# Altium schematic sheet PWM Generation.SchDoc: FET Drive PWM Circuit
size 246 x 182 mm; SheetNumber: 2; SheetTotal: 2; Page Create Date: March  8, 1995; OrgName: University of Illinois at Urbana-Champaign; Page Number: 3; Page Size: A; Page Count: 6; RevCode: 4; Doc: SK0003; DsnPath: C:\Users\w14r2\Downloads\FETBOX REV 4.DSN; SchematicName: FET Box Redesign Schematics; PageName: C - PWM Generation; PageSize: A; TopSchematic: True
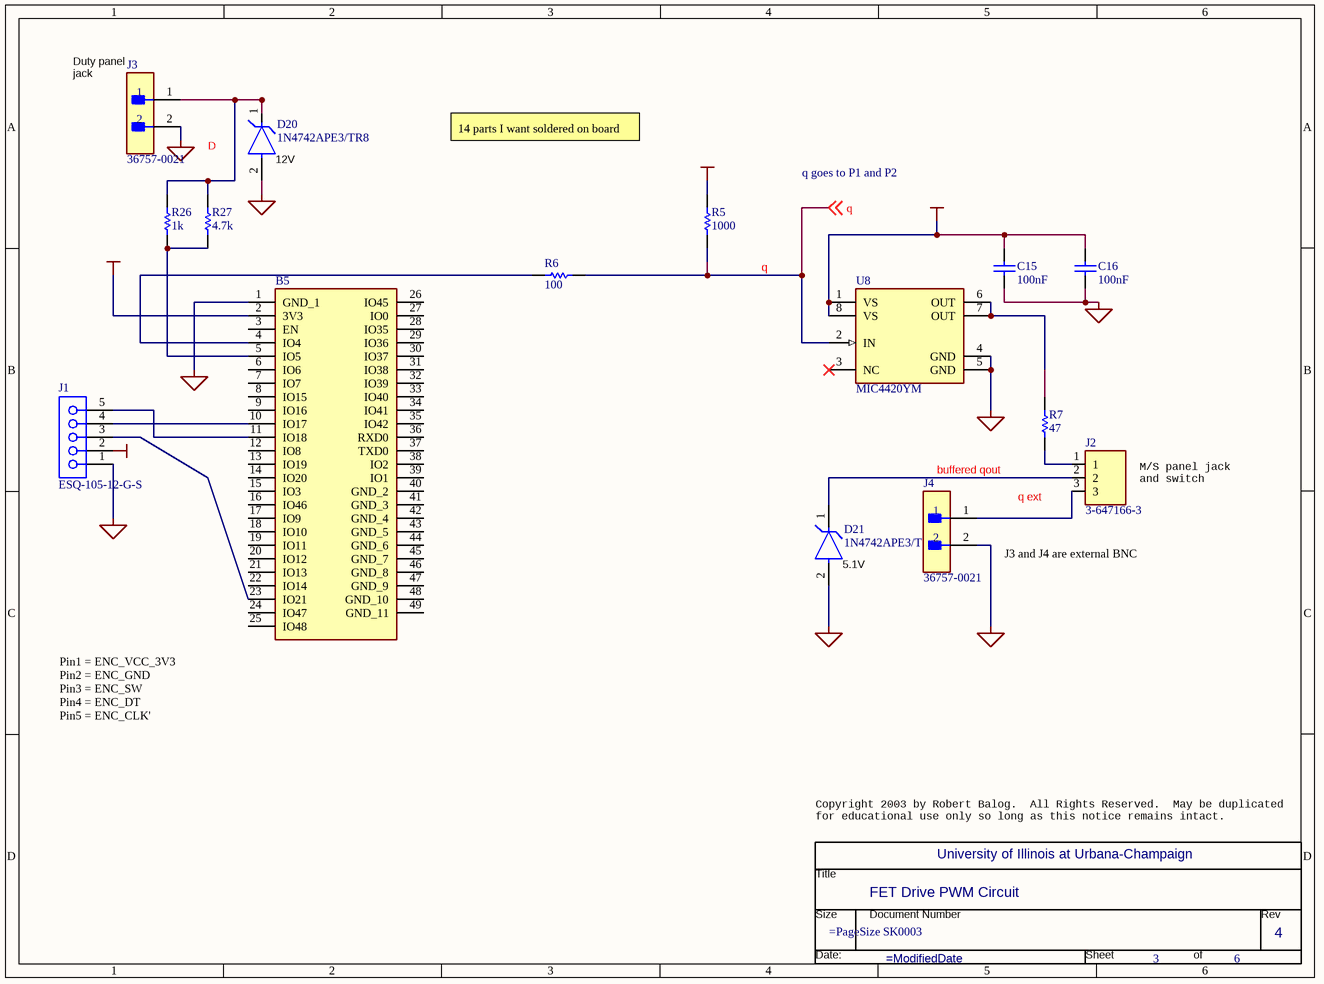
[diagram p0: PWM Generation.SchDoc]

## Parts
*  Page Count: 6  Page Number: 3  Title: FET Drive PWM Circuit  RevCode: 4  Doc: SK0003  OrgName: University of Illinois at Urbana-Champaign  (graphical)
B5  (no value)  [ESP32S3WROOM1N16R8]
C15  100nF  [CAPC2013X140X50ML20T25]
C16  100nF  [CAPC2013X140X50ML20T25]
D20  1N4742APE3/TR8  [FP-1N4742APE3-TR8-MFG]
D21  1N4742APE3/TR8  [FP-1N4742APE3-TR8-MFG]
J1  ESQ-105-12-G-S  [SMTC-ESQ-105-12-X-S]
J2  3-647166-3  [TE_3-647166-3]
J3  36757-0021  [FP-36757-0021-MFG]
J4  36757-0021  [FP-36757-0021-MFG]
R5  1000  [RESC2013X60X35NL10T20]
R6  100  [RESC2013X60X35NL10T20]
R7  47  [RESC2013X60X35NL10T20]
R26  1k  [RESC2013X60X35NL10T20]
R27  4.7k  [RESC2013X60X35NL10T20]
U8  MIC4420YM  [FP-SOICN-8LD-PL-1-IPC_C]

## Nets
3.3V: B5.2(3V3) J1.2
5V: C15.2 C16.2 R5.2 U8.1(VS) U8.8(VS)
GND: B5.1(GND_1) C15.1 C16.1 D20.2(A) D21.2(A) J1.1 J3.2 J4.2 U8.4(GND) U8.5(GND)
buffered qout: D21.1(C) J2.2
q: R5.1 R6.1 U8.2(IN) ; off-sheet q
NetB5_4: B5.4(IO4) R6.2
NetB5_5: B5.5(IO5) R26.2 R27.2
NetB5_10: B5.10(IO17) J1.4
NetB5_11: B5.11(IO18) J1.5
NetB5_23: B5.23(IO21) J1.3
NetD20_1: D20.1(C) J3.1 R26.1 R27.1
NetJ2_1: J2.1 R7.1
NetJ2_3: J2.3 J4.1
NetR7_2: R7.2 U8.6(OUT) U8.7(OUT)

Not connected (* = marked no-connect by the designer): B5 3(EN) 6(IO6) 7(IO7) 8(IO15) 9(IO16) 12(IO8) 13(IO19) 14(IO20) 15(IO3) 16(IO46) 17(IO9) 18(IO10) 19(IO11) 20(IO12) 21(IO13) 22(IO14) 24(IO47) 25(IO48) 26(IO45) 27(IO0) 28(IO35) 29(IO36) 30(IO37) 31(IO38) 32(IO39) 33(IO40) 34(IO41) 35(IO42) 36(RXD0) 37(TXD0) 38(IO2) 39(IO1) 40(GND_2) 41(GND_3) 42(GND_4) 43(GND_5) 44(GND_6) 45(GND_7) 46(GND_8) 47(GND_9) 48(GND_10) 49(GND_11); U8 3(NC)*

## Notes on the sheet
- (near J3) Duty panel
  jack
- (near D20) 12V
- 14 parts I want soldered on board (this + FET1,2 Sch.)
- q goes to P1 and P2
- M/S panel jack
  and switch
- (near D21) 5.1V
- J3 and J4 are external BNC
- Pin1 = ENC_VCC_3V3
  Pin2 = ENC_GND
  Pin3 = ENC_SW
  Pin4 = ENC_DT
  Pin5 = ENC_CLK'
- (near *) Copyright 2003 by Robert Balog.  All Rights Reserved.  May be duplicated
  for educational use only so long as this notice remains intact.
- Labels drawn without touching a wire or pin: 12V, D, q ext
- (in symbol TitleBlock0) Title; Size; Document Number; Rev; Date:; Sheet; of

## Library data of the parts
* = TitleBlock0: Page Size: =PageSize; Page Create Date: March  8, 1995; Page Modify Date: =ModifiedDate
B5 = ESP32-S3-WROOM-1-N16R8: Multiprotocol Modules SMD Module, ESP32-S3R8, 3.3V, 8 MB Octal PSRAM Die, 16 MB Quad SPI Flash, PCB Antenna; Manufacturer_Name: Espressif Systems; Geometry.Height: 3.25mm; Manufacturer_Part_Number: ESP32-S3-WROOM-1-N16R8; Mouser Part Number: 356-ESP32S3WRM1N16R8; Mouser Price/Stock: https://www.mouser.co.uk/ProductDetail/Espressif-Systems/ESP32-S3-WROOM-1-N16R8?qs=Li%252BoUPsLEnvQc9gW6AMhZg%3D%3D; Arrow Part Number: *; Arrow Price/Stock: *; Datasheet Link: https://www.espressif.com/sites/default/files/documentation/esp32-s3-wroom-1_wroom-1u_datasheet_en.pdf
C15 C16 = CMP-2007-04651-1: Part Number: 0805DD104KAT2A; Manufacturer: AVX Interconnect / Elco
D20 D21 = CMP-06360-000055-1: DIODE ZENER 12V 1W DO204AL
J1 = CMP-1026-00013-1: PC/104(TM) Elevated Socket Strip, Through-hole, Vertical, -55 to 125 degC, 2.54 mm Pitch, 5-Pin, Female, RoHS; Manufacturer: Samtec; Pitch: 2.54 mm; ComponentLink1Description: Manufacturer URL; Mounting Technology: Through-hole; DatasheetVersion: F-214; RoHS: True; ComponentLink3Description: Package Specification; PartNumber: ESQ-105-12-G-S; PackageReference: ESQ-105-12-X-S; PackageDescription: ESQ Strip ASM; Orientation: Vertical; ComponentLink2URL: http://www.samtec.com/documents/webfiles/pdf/ESQ_TH.PDF; PackageVersion: BZ, 9/1998; ComponentLink2Description: Datasheet; Temperature Range: -55 to 125 degC; ComponentLink3URL: http://www.samtec.com/documents/webfiles/cpdf/ESQ-1XX-XX-X-X-XXX-XX-X-XX-MKT.pdf; ComponentLink1URL: http://www.samtec.com
J2 = 3-647166-3: Header Assembly 3P MTA100 SM FL LF MTA-100 Series | TE Connectivity 3-647166-3; SnapEDA_Link: https://www.snapeda.com/parts/3-647166-3/TE+Connectivity+AMP+Connectors/view-part/?ref=snap; Package: None; Value: *; MF: TE Connectivity; MP: 3-647166-3; Check_prices: https://www.snapeda.com/parts/3-647166-3/TE+Connectivity+AMP+Connectors/view-part/?ref=eda
J3 J4 = CMP-04776-001022-1: CONN HEADER VERT 2POS 6.35MM; Number of Circuits: 2; Glow Wire Compliant: Compliant; Current Rating: 20A; Voltage Rating: 600V; Pitch: 6.35mm; Max Operating Temperature: 105°C; Number of Contacts: 2; Contact Material: Bronze; Contact Plating: Tin; Number of Positions: 2; Orientation: Vertical; Min Operating Temperature: -55°C; Number of Rows: 1; Packaging: Tray; Mount: Through Hole; Contact Gender: Male; Package Quantity: 1496; Flammability Rating: UL94 V-2; RoHS Compliant: Yes; Termination: Through Hole; Housing Material: Polyester; Series: 43255; Radiation Hardening: No
R5-R7 = CMP-2001-01341-1: Part Number: RC0805FR-1380K6L; Manufacturer: Yageo
R26 R27 = CMP-2001-01341-1: 100; Part Number: RC0805FR-1380K6L; Manufacturer: Yageo
U8 = CMP-06319-000007-1: IC GATE DRVR LOW-SIDE 8SOIC; Turn-Off Delay Time: 18ns; Output Voltage: 25mV; Supply Current: 450uA; Max Supply Voltage: 18V; Rise Time: 35ns; Number of Drivers: 1; Max Output Current: 6A; Max Power Dissipation: 1.04W; Min Supply Voltage: 4.5V; Channel Type: Single; Propagation Delay: 75ns; Output Impedance: 2.5R; Series: -; Width: 3.94mm; Length: 4.93mm; Turn-On Delay Time: 18ns; Number of Pins: 8; Min Operating Temperature: -40°C; Nominal Supply Current: 450uA; Case/Package: SOIC; Max Operating Temperature: 85°C; Package Quantity: 95; Number of Outputs: 1; Fall Time: 35ns; Packaging: Rail/Tube; Mount: Surface Mount; Output Current: 6A; Radiation Hardening: No; Height: 1.48mm; RoHS Compliant: Yes; Lead Free: Lead Free; Power Dissipation: 1.04W; REACH SVHC: No SVHC